# EasyEDA schematic fig2.json
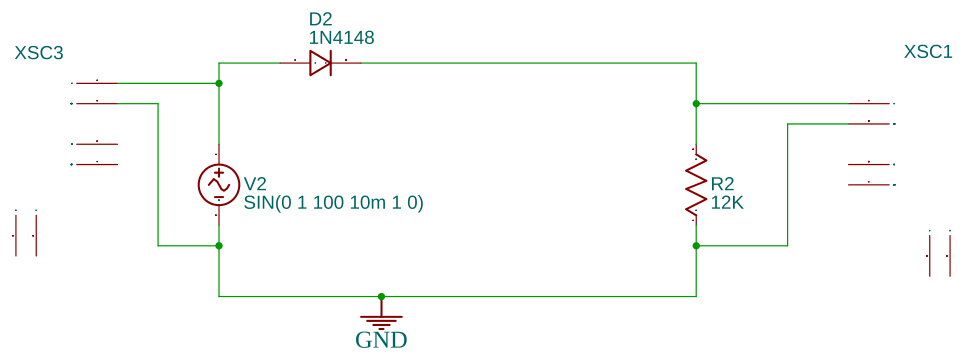
[diagram p0: schematic sheet]

## Parts
D2  1N4148  [DO-35]
R2  12K  [AXIAL-0.3]
V2  SIN(0 1 100 10m 1 0)  [HDR1X2]
XSC1  Oscilloscope
XSC3  Oscilloscope

## Library data of the parts
D2 = 1N4148: Contributor: EasyEDA
R2 = Resistor_US: Resistance: 1k; Contributor: EasyEDA; Supplier: YUJING
V2 = VSin: Contributor: EasyEDA; sim: true
XSC1 XSC3 = OSCILLOSCOPE: Contributor: EasyEDA; NameDisplay: 0; sim: true

## Nets
GND: R2.1 V2.2 XSC1.2(GND1) XSC3.2(GND1)
Net-(D2-1): D2.1(A) V2.1 XSC3.1(A)
Net-(D2-2): D2.2(K) R2.2 XSC1.1(A)

Not connected (* = marked no-connect by the designer): XSC1 3(B) 4(GND2) 5(T+) 6(T-); XSC3 3(B) 4(GND2) 5(T+) 6(T-)

## Notes on the sheet
- .tran 1
